# Altium project LED light with basic motion detection.PrjPcb
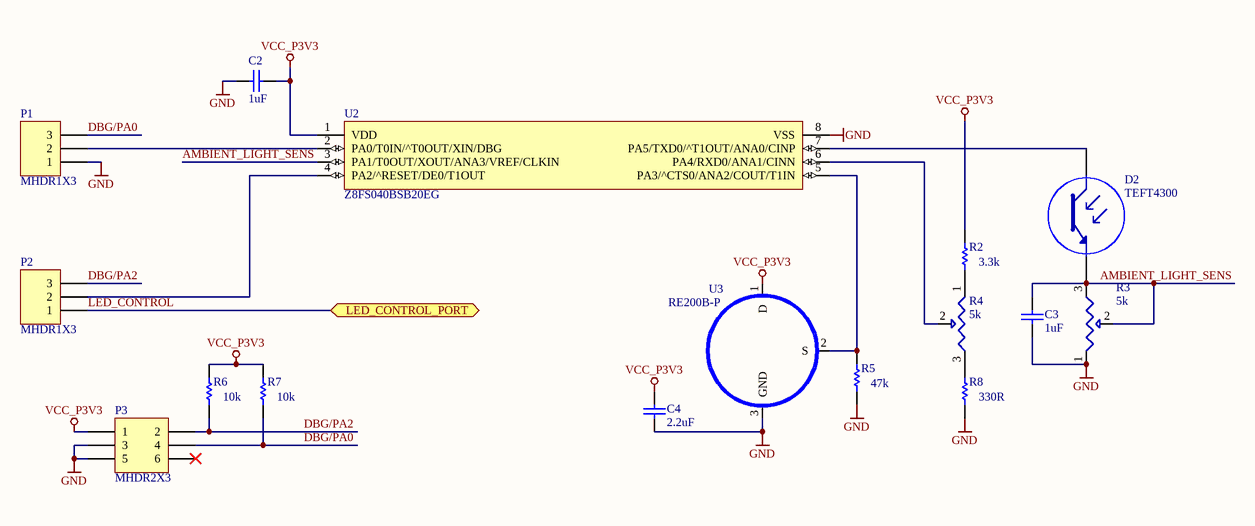
[diagram p0: motion sensor circuit.SchDoc]
3 sheets, 39 parts. Net scope: flat (ports and power ports of the same name join across sheets).
Board file: single LED design PCB.PcbDoc
Sheets:
  motion sensor circuit.SchDoc
  LED control circuit.SchDoc
  power management.SchDoc

## Sheet motion sensor circuit.SchDoc: Motion sensing circuit
size A4; Revision: 1.0.0; SheetNumber: 1; SheetTotal: 3

### Parts
C2  value 1uF  [1608[0603]]  (hidden comment: C0603C105K8PACTU)
C3  value 1uF  [1608[0603]]  (hidden comment: C0603C105K8PACTU)
C4  value 2.2uF  [1608[0603]]  (hidden comment: C0603C225K8PACTU)
D2  TEFT4300  [LED]
P1  MHDR1X3  [MHDR1X3]
P2  MHDR1X3  [MHDR1X3]
P3  MHDR2X3  [MHDR2X3]
R2  value 3.3k  [3-0603]  (hidden comment: ERJ-3GEYJ332V)
R3  value 5k  [3386F]  (hidden comment: 3386F-1-502)
R4  value 5k  [3386F]  (hidden comment: 3386F-1-502)
R5  value 47k  [3-0603]  (hidden comment: ERJ-3GEYJ473V)
R6  value 10k  [3-0603]  (hidden comment: ERJ-3GEYJ103V)
R7  value 10k  [3-0603]  (hidden comment: ERJ-3GEYJ103V)
R8  value 330R  [3-0603]  (hidden comment: ERJ-3GEYJ331V)
U2  Z8FS040BSB20EG  [SOIC127P600X173-8N]
U3  RE200B-P  [RE200B-P]

### Ports
LED_CONTROL_PORT

### Nets
GND: C2.2 C3.2 C4.2 P1.1 P3.3 P3.5 R3.1 R5.1 R8.1 U2.8(VSS) U3.3(GND)
VCC_P3V3: C2.1 C4.1 P3.1 R2.2 R6.2 R7.2 U2.1(VDD) U3.1(D)
AMBIENT_LIGHT_SENS: C3.1 D2.2 R3.2 R3.3 U2.3(PA1/T0OUT/XOUT/ANA3/VREF/CLKIN)
DBG/PA0: P1.3 P3.4 R7.1
DBG/PA2: P2.3 P3.2 R6.1
LED_CONTROL: P2.1 ; port LED_CONTROL_PORT
NetD2_1: D2.1 U2.7(PA5/TXD0/^T1OUT/ANA0/CINP)
NetP1_2: P1.2 U2.2(PA0/T0IN/^T0OUT/XIN/DBG)
NetP2_2: P2.2 U2.4(PA2/^RESET/DE0/T1OUT)
NetR2_1: R2.1 R4.1
NetR4_2: R4.2 U2.6(PA4/RXD0/ANA1/CINN)
NetR4_3: R4.3 R8.2
NetR5_2: R5.2 U2.5(PA3/^CTS0/ANA2/COUT/T1IN) U3.2(S)

Not connected (* = marked no-connect by the designer): P3 6*

### Notes on the sheet
- Title
- Size:
- Date:
- A4
- Number:
- Time:
- Revision:
- Sheet
- of
- File:

### Library data of the parts
C2-C4 = C0603: Ceramic Chip Capacitor - Standard; Note: Footprint corresponds to dimensions for bulk cassette packaging. This case size has tightened tolerances.; Published: 17-Jul-2002; LatestRevisionDate: 19-Mar-2004; LatestRevisionNote: Silkscreen size reduced.; DatasheetDocument: Mar-2001; PackageDocument: Mar-2001; PackageReference: 0603; Publisher: Altium Limited; Code_JEITA: 0603; Code_IPC: 1608 [0603]; ComponentLink1Description: Manufacturer Link; ComponentLink1URL: http://www.kemet.com/; ComponentLink2Description: Datasheet; ComponentLink2URL: http://www.kemet.com/kemet/web/homepage/kechome.nsf/vapubfilesname/F3102TA.pdf/$file/F3102TA.pdf
D2 = TEFT4300: Silicon NPN Phototransistor
P1 P2 = MHDR1X3: Header, 3-Pin; LatestRevisionDate: 17-Jul-2002; LatestRevisionNote: Re-released for DXP Platform.; Publisher: Altium Limited
P3 = MHDR2X3: Header, 3-Pin, Dual row; LatestRevisionDate: 17-Jul-2002; LatestRevisionNote: Re-released for DXP Platform.; Publisher: Altium Limited
R2 R5-R8 = ERJ3EK: Precision Thick Film Chip Resistor, 10 Ohm to 1M Ohm Range, 1% and 0.5% Tolerance, 0603 Size, 0.063 W; Published: 17-Dec-2003; LatestRevisionDate: 19-Mar-2004; LatestRevisionNote: Silkscreen size reduced.; PackageDocument: Mar-2003; PackageReference: 3-0603; Publisher: Altium Limited; Code_IPC: 1608 [0603]; ComponentLink1Description: Manufacturer Link; ComponentLink1URL: http://www.panasonic.com/industrial/components/resistive_products.htm; ComponentLink2Description: Datasheet; ComponentLink2URL: http://www.panasonic.com/industrial/components/pdf/AOA0000CE2.pdf
R3 R4 = 3386F-1-XXX: 3386 - 3/8 ” Square Trimpot Trimming Potentiometer
U2 = Z8FS040BSB20EG: 8-bit Microcontrollers - MCU ZMotion MCU Mot Det IC, 4KB Flash
U3 = RE200B-P: Pyroelectric Passive Infrared Sensor

## Sheet LED control circuit.SchDoc: LED control Circuit
size A4; Revision: 1.0.0; SheetNumber: 2; SheetTotal: 3
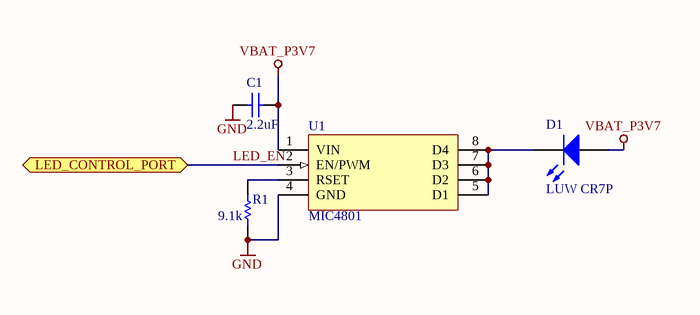
[diagram p1: LED control circuit.SchDoc]

### Parts
C1  value 2.2uF  [1608[0603]]  (hidden comment: C0603C225K8PACTU)
D1  LUW CR7P  [LUW CR7P]
R1  value 9.1k  [3-0603]  (hidden comment: ERJ-3GEYJ912V)
U1  MIC4801  [SOIC-8N]

### Ports
LED_CONTROL_PORT

### Nets
GND: C1.1 D1.3(PAD) R1.1 U1.4(GND)
VBAT_P3V7: C1.2 D1.1(A) U1.1(VIN)
LED_EN: U1.2(EN/PWM) ; port LED_CONTROL_PORT  [project net LED_CONTROL]
NetD1_2: D1.2(K) U1.5(D1) U1.6(D2) U1.7(D3) U1.8(D4)
NetR1_2: R1.2 U1.3(RSET)

### Notes on the sheet
- Title
- Size:
- Date:
- A4
- Number:
- Time:
- Revision:
- Sheet
- of
- File:

### Library data of the parts
C1 = C0603: as C2 on sheet motion sensor circuit; Published: 17-Jul-2002; LatestRevisionDate: 19-Mar-2004; LatestRevisionNote: Silkscreen size reduced.; DatasheetDocument: Mar-2001; PackageDocument: Mar-2001; PackageReference: 0603; Publisher: Altium Limited; Code_JEITA: 0603; Code_IPC: 1608 [0603]; ComponentLink1Description: Manufacturer Link; ComponentLink1URL: http://www.kemet.com/; ComponentLink2Description: Datasheet; ComponentLink2URL: http://www.kemet.com/kemet/web/homepage/kechome.nsf/vapubfilesname/F3102TA.pdf/$file/F3102TA.pdf
D1 = LUW CR7P: High birghtness white LED, SMD, 150lm, 80 degree
R1 = ERJ3EK: as R2 on sheet motion sensor circuit; Published: 17-Dec-2003; LatestRevisionDate: 19-Mar-2004; LatestRevisionNote: Silkscreen size reduced.; PackageDocument: Mar-2003; PackageReference: 3-0603; Publisher: Altium Limited; Code_IPC: 1608 [0603]; ComponentLink1Description: Manufacturer Link; ComponentLink1URL: http://www.panasonic.com/industrial/components/resistive_products.htm; ComponentLink2Description: Datasheet; ComponentLink2URL: http://www.panasonic.com/industrial/components/pdf/AOA0000CE2.pdf
U1 = MIC4801: WLED driver, 600mA, linear LDO, constant current

## Sheet power management.SchDoc: Power Management circuit
size A4; Revision: 1.0.0; SheetNumber: 3; SheetTotal: 3
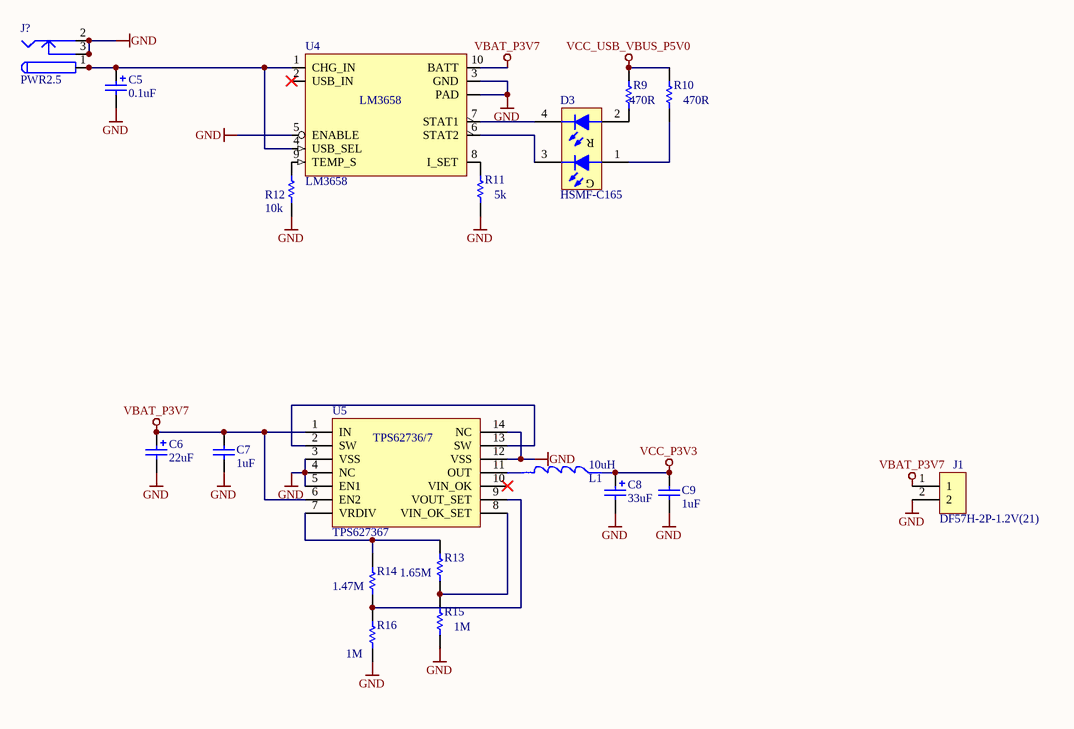
[diagram p2: power management.SchDoc]

### Parts
C5  value 0.1uF  [A]  (hidden comment: T491A104M035AT)
C6  value 22uF  [A]  (hidden comment: T491A226M010ZT)
C7  value 1uF  [1608[0603]]  (hidden comment: C0603C105K8PACTU)
C8  value 33uF  [A]  (hidden comment: T491A336K010AT)
C9  value 1uF  [1608[0603]]  (hidden comment: C0603C105K8PACTU)
D3  HSMF-C165  [1.6X0.8X0.5]
J1  DF57H-2P-1.2V(21)  [DF57H-2P-1.2V(21)]
J?  PWR2.5  [KLD-0202]
L1  value 10uH  [WE-TPC]  (hidden comment: 744029100)
R9  value 470R  [3-0603]  (hidden comment: ERJ-3GEYJ471V)
R10  value 470R  [3-0603]  (hidden comment: ERJ-3GEYJ471V)
R11  value 5k  [3-0603]  (hidden comment: ERJ-3GEYJ502V)
R12  value 10k  [3-0603]  (hidden comment: ERJ2GEJ103X)
R13  value 1.65M  [3-0603]  (hidden comment: CRCW06031M65FKEA)
R14  value 1.47M  [3-0603]  (hidden comment: CRCW06031M47FKEA)
R15  value 1M  [3-0603]  (hidden comment: ERJ-3GEYJ105V)
R16  value 1M  [3-0603]  (hidden comment: ERJ-3GEYJ105V)
U4  LM3658  [WSON10]
U5  TPS627367  [QFN50P350X350X100_HS-15N]

### Nets
GND: C5.2 C6.2 C7.2 C8.2 C9.2 J1.2 J?.2 J?.2A J?.2B J?.3 J?.3A J?.3B R11.1 R12.1 R15.1 R16.1 U4.3(GND) U4.5(ENABLE) U4.11(PAD) U5.3(VSS) U5.4(NC) U5.5(EN1) U5.12(VSS) U5.14(NC) U5.15(PAD)
VBAT_P3V7: C6.1 C7.1 J1.1 U4.10(BATT) U5.1(IN) U5.6(EN2)
VCC_P3V3: C8.1 C9.1 L1.2
VCC_USB_VBUS_P5V0: R9.2 R10.2
NetC5_1: C5.1 J?.1 J?.1A J?.1B U4.1(CHG_IN) U4.4(USB_SEL)
NetD3_1: D3.1(A1) R10.1
NetD3_2: D3.2(A2) R9.1
NetD3_3: D3.3(K1) U4.6(STAT2)
NetD3_4: D3.4(K2) U4.7(STAT1)
NetL1_1: L1.1 U5.11(OUT)
NetR11_2: R11.2 U4.8(I_SET)
NetR12_2: R12.2 U4.9(TEMP_S)
NetR13_1: R13.1 R15.2 U5.8(VIN_OK_SET)
NetR13_2: R13.2 R14.2 U5.7(VRDIV)
NetR14_1: R14.1 R16.2 U5.9(VOUT_SET)
NetU5_2: U5.2(SW) U5.13(SW)

Not connected (* = marked no-connect by the designer): U4 2(USB_IN)*; U5 10(VIN_OK)*

### Notes on the sheet
- Title
- Size:
- Date:
- A4
- Number:
- Time:
- Revision:
- Sheet
- of
- File:
- (in symbol HSMF-C165) R; G
- (in symbol TPS62737) TPS62736/7

### Library data of the parts
C5 = T491A: Tantalum Chip Capacitor, 0.1uF, 35V, 20%, package 1206,  T491 Series; Published: 17-Jul-2002; LatestRevisionDate: 19-Mar-2004; LatestRevisionNote: Silkscreen dimensions re-sized.; DatasheetDocument: Mar-2001; PackageDocument: Mar-2001; PackageReference: A; Publisher: Altium Limited; Code_JEITA: 3216-18; ComponentLink1Description: Manufacturer Link; ComponentLink1URL: http://www.kemet.com/; ComponentLink2Description: Datasheet; ComponentLink2URL: http://www.kemet.com/kemet/web/homepage/kechome.nsf/vapubfilesname/F3102TA.pdf/$file/F3102TA.pdf
C6 = T491A: Tantalum Chip Capacitor, 22uF, 10V, 20%, package 1206,  T491 Series; Published: 17-Jul-2002; LatestRevisionDate: 19-Mar-2004; LatestRevisionNote: Silkscreen dimensions re-sized.; DatasheetDocument: Mar-2001; PackageDocument: Mar-2001; PackageReference: A; Publisher: Altium Limited; Code_JEITA: 3216-18; ComponentLink1Description: Manufacturer Link; ComponentLink1URL: http://www.kemet.com/; ComponentLink2Description: Datasheet; ComponentLink2URL: http://www.kemet.com/kemet/web/homepage/kechome.nsf/vapubfilesname/F3102TA.pdf/$file/F3102TA.pdf
C7 C9 = C0603: as C2 on sheet motion sensor circuit; Published: 17-Jul-2002; LatestRevisionDate: 19-Mar-2004; LatestRevisionNote: Silkscreen size reduced.; DatasheetDocument: Mar-2001; PackageDocument: Mar-2001; PackageReference: 0603; Publisher: Altium Limited; Code_JEITA: 0603; Code_IPC: 1608 [0603]; ComponentLink1Description: Manufacturer Link; ComponentLink1URL: http://www.kemet.com/; ComponentLink2Description: Datasheet; ComponentLink2URL: http://www.kemet.com/kemet/web/homepage/kechome.nsf/vapubfilesname/F3102TA.pdf/$file/F3102TA.pdf
C8 = T491A: Tantalum Chip Capacitor, 33uF, 10V, 20%, package 1206,  T491 Series; Published: 17-Jul-2002; LatestRevisionDate: 19-Mar-2004; LatestRevisionNote: Silkscreen dimensions re-sized.; DatasheetDocument: Mar-2001; PackageDocument: Mar-2001; PackageReference: A; Publisher: Altium Limited; Code_JEITA: 3216-18; ComponentLink1Description: Manufacturer Link; ComponentLink1URL: http://www.kemet.com/; ComponentLink2Description: Datasheet; ComponentLink2URL: http://www.kemet.com/kemet/web/homepage/kechome.nsf/vapubfilesname/F3102TA.pdf/$file/F3102TA.pdf
D3 = HSMF-C165: Miniature Bi-Colour Surface Mount Chip LED (Red/Green); LuminousIntensity: 2.5mcd (Minimum).; LED_Colour: Red & Green; PCB_Layout: Complies with manufacturer's recommendation.; Published: 11-Dec-2002; DatasheetVersion: 6-Apr-2002; PackageVersion: 6-Apr-2002; PackageReference: 1.6X0.8X0.5; Publisher: Altium Limited; PackageDescription: SM LED, Bi-Colour; 4 Flat Leads; Body 1.6 x 0.8 x 0.5 mm (LxWxH); ComponentLink1Description: Manufacturer Link; ComponentLink1URL: http://www.avagotech.com/; ComponentLink2Description: Datasheet; ComponentLink2URL: http://cp.literature.agilent.com/litweb/pdf/5988-6146EN.pdf
J1 = DF57H-2P-1.2V(21): low profile connector, 1.2mm pitch, SMD, 2 pin
J? = PWR2.5: Low Voltage Power Supply Connector; Published: 17-Dec-2003; DatasheetDocument: 09-May-2002; Publisher: Altium Limited; ComponentLink1Description: Manufacturer Link; ComponentLink1URL: http://domino.kycon.com/internet/Products.html
L1 = 744029100: SMD power inductor, 10uH, .75A
R9-R11 R13-R16 = ERJ3EK: as R2 on sheet motion sensor circuit; Published: 17-Dec-2003; LatestRevisionDate: 19-Mar-2004; LatestRevisionNote: Silkscreen size reduced.; PackageDocument: Mar-2003; PackageReference: 3-0603; Publisher: Altium Limited; Code_IPC: 1608 [0603]; ComponentLink1Description: Manufacturer Link; ComponentLink1URL: http://www.panasonic.com/industrial/components/resistive_products.htm; ComponentLink2Description: Datasheet; ComponentLink2URL: http://www.panasonic.com/industrial/components/pdf/AOA0000CE2.pdf
R12 = ERJ2GE: Thick Film Chip Resistor, 10k Ohm Range, 5% Tolerance, 0402 Size, 0.063 W; Note: If flow soldering, adjust pad width of PCB Footprint to 0.7 - 0.8 times the width of the resistor.; Published: 17-Dec-2003; LatestRevisionDate: 19-Mar-2004; LatestRevisionNote: Silkscreen size reduced.; PackageDocument: Mar-2003; PackageReference: 2-0402; Publisher: Altium Limited; Code_IPC: 1005 [0402]; ComponentLink1Description: Manufacturer Link; ComponentLink1URL: http://www.panasonic.com/industrial/components/resistive_products.htm; ComponentLink2Description: Datasheet; ComponentLink2URL: http://www.panasonic.com/industrial/components/pdf/AOA0000CE1.pdf
U4 = LM3658: Dual Source USB/AC Li Chemistry Charger IC
U5 = TPS62737: ultra-low power buck converter, 50/200mA, enable pin

## Nets that join several sheets
GND: motion sensor circuit (11 pins), LED control circuit (C1.1 D1.3 R1.1 U1.4), power management (25 pins)
VBAT_P3V7: LED control circuit (C1.2 D1.1 U1.1), power management (6 pins)
VCC_P3V3: motion sensor circuit (8 pins), power management (C8.1 C9.1 L1.2)
LED_CONTROL: motion sensor circuit (P2.1), LED control circuit (U1.2)